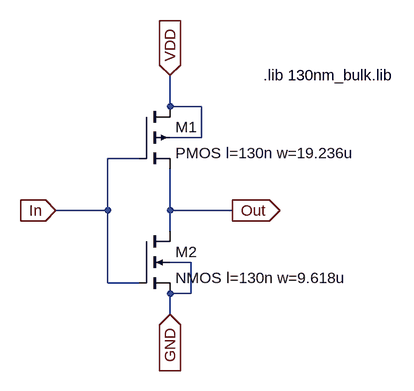
[diagram p0: schematic Inverter_A.asc]
Inverter_A.asc, the LTspice schematic file:
Version 4
SHEET 1 880 680
WIRE 128 16 128 -32
WIRE 176 16 128 16
WIRE 176 64 176 16
WIRE 176 64 128 64
WIRE 80 96 32 96
WIRE 32 176 32 96
WIRE 32 176 -48 176
WIRE 128 176 128 112
WIRE 224 176 128 176
WIRE 128 208 128 176
WIRE 160 256 128 256
WIRE 32 288 32 176
WIRE 80 288 32 288
WIRE 160 304 160 256
WIRE 160 304 128 304
WIRE 128 336 128 304
FLAG 128 -32 VDD
IOPIN 128 -32 In
FLAG 128 336 GND
IOPIN 128 336 In
FLAG -48 176 In
IOPIN -48 176 In
FLAG 224 176 Out
IOPIN 224 176 Out
SYMBOL pmos4 80 16 R0
SYMATTR InstName M1
SYMATTR Value2 l=130n w=19.236u
SYMATTR Value PMOS l=130n w=19.236u
SYMBOL nmos4 80 208 R0
SYMATTR InstName M2
SYMATTR Value2 l=130n w=9.618u
SYMATTR Value NMOS l=130n w=9.618u
TEXT 272 -32 Left 2 !.lib 130nm_bulk.lib

The netlist it stands for:
* Inverter_A.asc
M1 VDD In Out VDD PMOS l=130n w=19.236u l=130n w=19.236u
M2 Out In GND GND NMOS l=130n w=9.618u l=130n w=9.618u
.model NMOS NMOS
.model PMOS PMOS
.lib standard.mos
.lib 130nm_bulk.lib
.backanno
.end